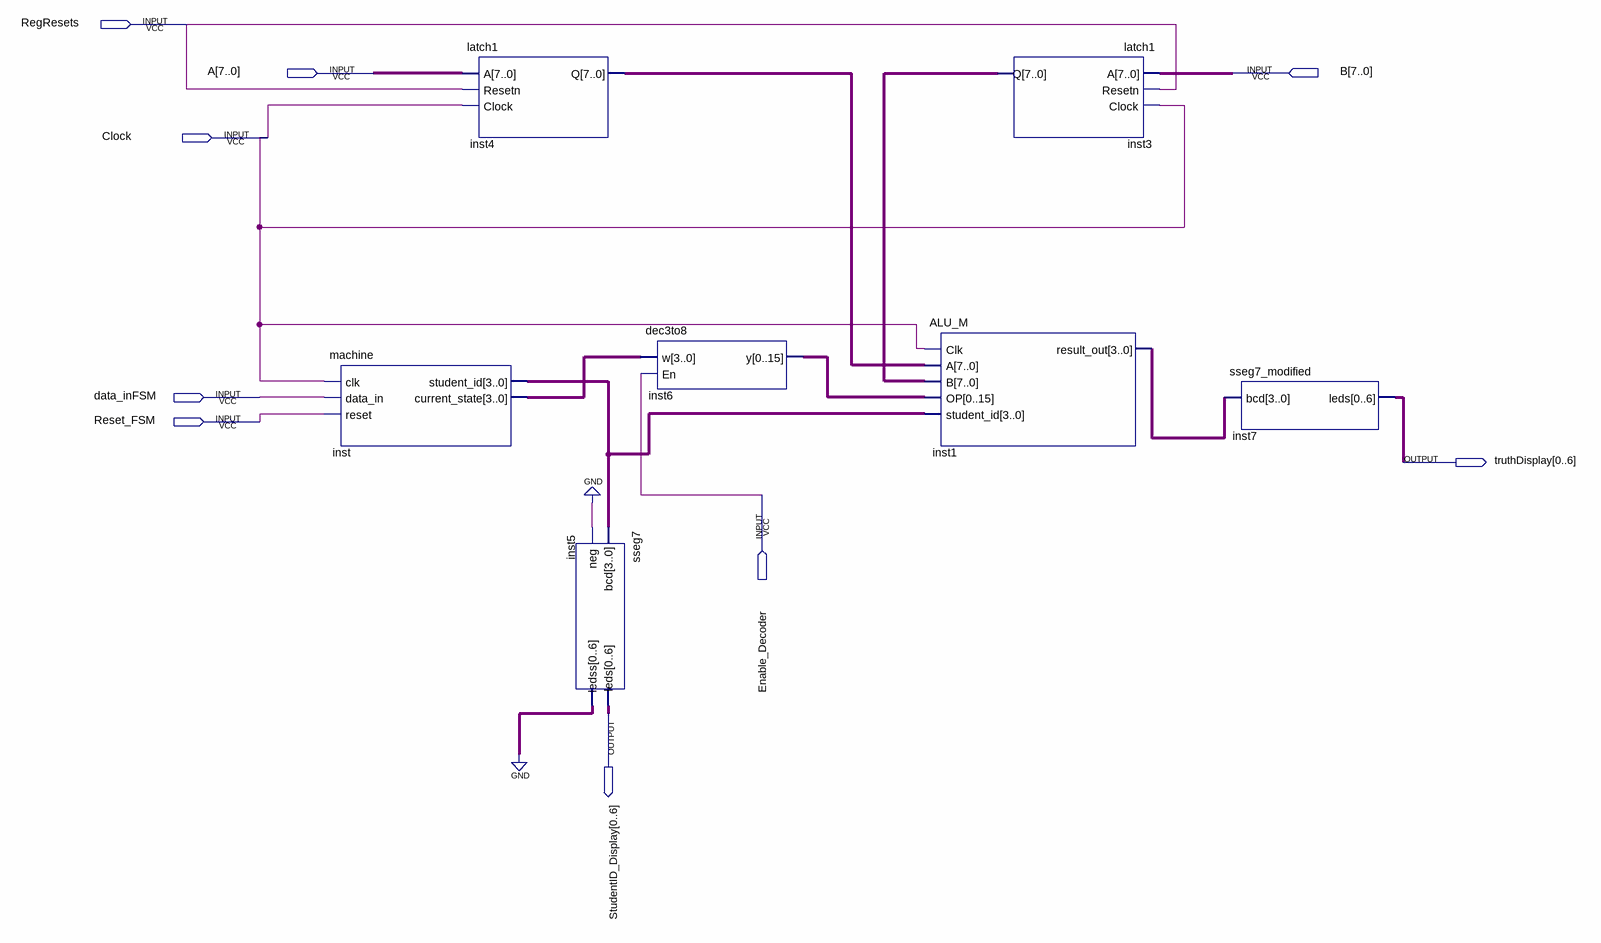
[diagram p0: schematic sheet]
// Quartus schematic lab6_problem3.bdf as structural Verilog: 7 symbols, 9 pins
module lab6_problem3 (
  input  RegResets,
  input  [7:0] A,
  input  [7:0] B,
  input  Clock,
  input  data_inFSM,
  input  Reset_FSM,
  input  Enable_Decoder,
  output [0:6] truthDisplay,
  output [0:6] StudentID_Display
);

  wire [3:0] inst1_result_out, inst_current_state, inst_student_id;
  wire [6:0] inst5_ledss;
  wire [7:0] inst3_q, inst4_q;
  wire [15:0] inst6_y;

  machine inst (
    .clk(Clock), .data_in(data_inFSM), .reset(Reset_FSM), .student_id(inst_student_id),
    .current_state(inst_current_state));
  latch1 inst4 (.A(A), .Resetn(RegResets), .Clock(Clock), .Q(inst4_q));
  sseg7 inst5 (.bcd(inst_student_id), .neg(1'b0), .leds(StudentID_Display), .ledss(inst5_ledss));
  dec3to8 inst6 (.w(inst_current_state), .En(Enable_Decoder), .y(inst6_y));
  ALU_M inst1 (
    .Clk(Clock), .A(inst4_q), .B(inst3_q), .OP(inst6_y), .student_id(inst_student_id),
    .result_out(inst1_result_out));
  latch1 inst3 (.A(B), .Resetn(RegResets), .Clock(Clock), .Q(inst3_q));
  sseg7_modified inst7 (.bcd(inst1_result_out), .leds(truthDisplay));
  // also tied to GND on the sheet: {inst5_ledss[0], inst5_ledss[1], inst5_ledss[2], inst5_ledss[3], inst5_ledss[4], inst5_ledss[5], inst5_ledss[6]}
endmodule
